# Altium schematic sheet PULSE_TRIGGER.SchDoc: =TopTitle
size 420 x 297 mm; EDA_Number: ARTIQ; CheckedBy: -; Author: G.Kasprowicz; CompanyName: WUT ISE; DrawnBy: G.Kasprowicz; Organization: WUT ISE; Address1: PW ISE; Address2: Nowowiejska 15/19 00-665 Warsaw; Address3: gkasprow@gmail.com; SheetNumber: -; SheetTotal: -; ModifiedBy: -; CheckedDate: -; Title2: Pulse Trigger; DivGrp: WUT ISE; Designer: G.Kasprowicz; ModifiedDate: -; ProjectName: Sensor Box
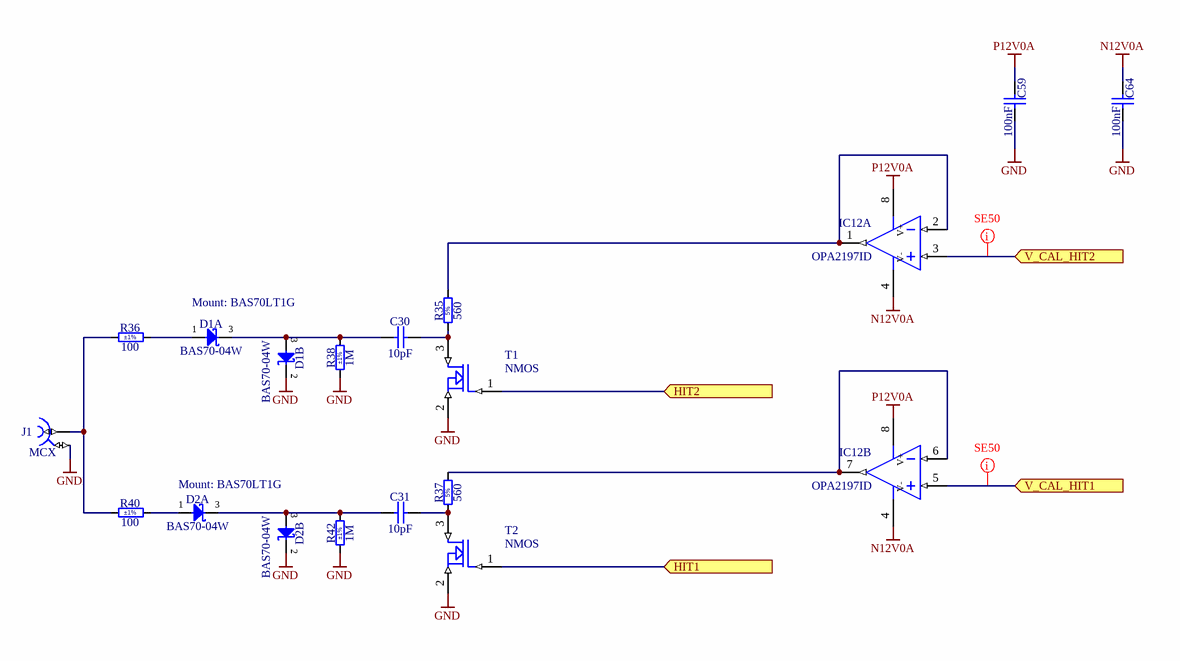
[diagram p0: PULSE_TRIGGER.SchDoc]

## Parts
C30  10pF  [CAPC1608X87N]
C31  10pF  [CAPC1608X87N]
C59  100nF  [CAPC1005X55N]
C64  100nF  [CAPC1005X55N]
D1  BAS70-04W  [SOT65P210X110-3N]  (parts A,B of 2)
D2  BAS70-04W  [SOT65P210X110-3N]  (parts A,B of 2)
IC12  OPA2197ID  [SOIC127P600X175-8N]  (parts A,B of 2)
J1  MCX  [AMPHENOL_919-383J-51A]
R35  560  [RESC2012X70N]
R36  100  Tolerance: ±1%  [RESC1608X55N]
R37  560  [RESC2012X70N]
R38  1M  Tolerance: ±1%  [RESC1608X55N]
R40  100  Tolerance: ±1%  [RESC1608X55N]
R42  1M  Tolerance: ±1%  [RESC1608X55N]
T1  NMOS  [CSD15380F3]
T2  NMOS  [CSD15380F3]

## Ports
HIT1 (in), HIT2 (in), V_CAL_HIT1 (in), V_CAL_HIT2 (in)

## Nets
GND: C59.1 C64.1 D1.2(C) D2.2(C) J1.2 R38.1 R42.1 T1.2(S) T2.2(S)
N12V0A: C64.2 IC12.4(V-)
P12V0A: C59.2 IC12.8(V+)
HIT1: T2.1(G) ; port HIT1
HIT2: T1.1(G) ; port HIT2
V_CAL_HIT1: IC12.5(IN+) ; port V_CAL_HIT1
V_CAL_HIT2: IC12.3(IN+) ; port V_CAL_HIT2
NetC30_1: C30.1 D1.3(COMAC) R38.2
NetC30_2: C30.2 R35.1 T1.3(D)
NetC31_1: C31.1 D2.3(COMAC) R42.2
NetC31_2: C31.2 R37.1 T2.3(D)
NetD1_1: D1.1(A) R36.2
NetD2_1: D2.1(A) R40.2
NetIC12_1: IC12.1(OUT) IC12.2(IN-) R35.2
NetIC12_6: IC12.6(IN-) IC12.7(OUT) R37.2
NetJ1_1: J1.1 R36.1 R40.1

## Layout directives
net class SE50: V_CAL_HIT1, V_CAL_HIT2

## Notes on the sheet
- (near D1) Mount: BAS70LT1G
- (near D2) Mount: BAS70LT1G
- Project/Equipment
- Document
- Designer
- Drawn by
- Check.by
- Copyright WUT ISE 2020.
  This documentation describes Open Hardware and is licensed under the CERN OHL v.1.2. You may redistribute and modify this documentation under the terms of the CERN OHL v.1.2. (http://ohwr.org/CERNOHL). This documentation is distributed WITHOUT ANY EXPRESS OR IMPLIED WARRANTY, INCLUDING OF MERCHANTABILITY, SATISFACTORY QUALITY AND FITNESS FOR A PARTICULAR PURPOSE. Please see the CERN OHL v.1.2 for applicable conditions.
- Contact
- File
- Last Mod.
- Print Date
- Sheet
- Size
- A3
- of
- Rev
- (in symbol R0805_560R_5%_0.25W_200PPM_PANASONIC_ERJT) 5%

## Library data of the parts
C30 C31 = CC0603_10PF_50V_5%_NP0: Non-polarised capacitor; Part Description: SMD Multilayer Chip Ceramic Capacitor; Manufacturer: GENERIC; Manufacturer1 Part Number: 223886715109; Voltage: 50V; TC: C0G/NP0; Tolerance: ±5%; Part Number: CC0603_10PF_50V_5%_NP0; Component Kind: Standard; Component Type: Standard; Pin Count: 2; Value: 10pF; Status: Preferred; Manufacturer Part Number: CC0603_10PF_50V_5%_NP0; Case: 0603; Mounted: Yes; Socket: No; SMD: Yes; Sense: No; Manufacturer1 Example: PHYCOMP; Manufacturer1 ComponentHeight: 0.87mm; HelpURL: \\cern.ch\dfs\Applications\Altium\Datasheets\CC0603_NP0_PHYCOMP.pdf; Author: CERN DEM JLC; CreateDate: 03.12.2007; LatestRevisionDate: 03.12.2007
C59 C64 = CC0402_100NF_16V_10%_X7R: Non-polarised capacitor; Part Description: SMD Multilayer Chip Ceramic Capacitor; Manufacturer: GENERIC; Manufacturer1 Part Number: GRM155R71C104KA88D; Voltage: 16V; TC: X7R; Tolerance: ±10%; Part Number: CC0402_100NF_16V_10%_X7R; Component Kind: Standard; Component Type: Standard; Pin Count: 2; Value: 100nF; Status: Not Recommended; Manufacturer Part Number: CC0402_100NF_16V_10%_X7R; Case: 0402; Mounted: Yes; Socket: No; SMD: Yes; Sense: No; Manufacturer1 Example: MURATA; Manufacturer1 ComponentHeight: 0.55mm; HelpURL: \\cern.ch\dfs\Applications\Altium\Datasheets\CC0402_X7R_MURATA_GRM.pdf; Author: CERN DEM JLC; CreateDate: 05.12.2013; LatestRevisionDate: 03.12.2007
D1 D2 = BAS70-04W: Serial Schottky Diode; Part Description: Dual Series General-Purpose Schottky Diodes; Manufacturer: NXP SEMICONDUCTORS; Voltage: 70V; Power: 70mA; PressFit: No; Bonding: No; Part Number: BAS70-04W; Component Kind: Standard; Component Type: Standard; Device: BAS70-04W; PackageDescription: SOT323, 0.65mm Pitch; 3 Pin, 1.25mm W X 2.00mm L X 1.10mm H body, IPC Medium Density; Manufacturer Part Number: BAS70-04W; Pin Count: 3; Case: SOT323; Mounted: Yes; Socket: No; SMD: Yes; Sense: No; ComponentHeight: 1.10mm; HelpURL: \\cern.ch\dfs\Applications\Altium\Datasheets\BAS70-04W.pdf; Author: CERN DEM JLC; CreateDate: 05.12.2013; LatestRevisionDate: 05.12.2013
IC12 = OPA2197ID: Dual Operational Amplifier; Part Description: Dual, 36-V, Precision, Rail-to-Rail Input/Output, Low Offset Voltage, Operational Amplifiers; Manufacturer: TEXAS INSTRUMENTS; PressFit: No; Bonding: No; Part Number: OPA2197ID; Component Kind: Standard; Component Type: Standard; Device: OPA2197ID; PackageDescription: SOIC 8, Pitch 1.27mm - Body 4x5mm, IPC Medium Density; Manufacturer Part Number: OPA2197ID; Pin Count: 8; Case: SOIC8; Mounted: Yes; Socket: No; SMD: Yes; Sense: No; ComponentHeight: 1.75mm; Author: CERN DEM MR; HelpURL: \\cern.ch\dfs\Applications\Altium\Datasheets\OPA2197ID.pdf; CreateDate: 07.08.2019; LatestRevisionDate: 07.08.2019
J1 = AMPHENOL_919-383J-51A: Part Description: 50 Ohms, RF Connector, MCX Right Angle PCB Receptacle Jack; PressFit: No; Part Number: AMPHENOL_919-383J-51A; Component Kind: Standard; Component Type: Standard; Pin Count: 5; Family: MCX; Mounted: Yes; Socket: No; SMD: No; Sense: No; Status: None; Manufacturer: AMPHENOL; Manufacturer Part Number: 919-383J-51A; ComponentHeight: 6mm; HelpURL: \\cern.ch\dfs\Applications\Altium\Datasheets\AMPHENOL_919-383J-51A.pdf; Author: CERN DEM BC; CreateDate: 31.01.2019; LatestRevisionDate: 31.01.2019
R35 R37 = R0805_560R_5%_0.25W_200PPM_PANASONIC_ERJT: Resistor - 5%; Part Description: 200V, Anti-Pulse Thick Film Chip Resistor; Manufacturer Part Number: ERJT06J561V; Power: 0.25W; TC: ±200ppm/°C; Voltage: 200V; PressFit: No; Part Number: R0805_560R_5%_0.25W_200PPM_PANASONIC_ERJT; Component Kind: Standard; Component Type: Standard; Pin Count: 2; Value: 560; Status: None; Tolerance: ±5%; Manufacturer: PANASONIC; Case: 0805; Mounted: Yes; Sense: No; Socket: No; SMD: Yes; ComponentHeight: 0.7mm; HelpURL: \\cern.ch\dfs\Applications\Altium\Datasheets\R0805_PANASONIC_ERJT06.pdf; Author: CERN DEM MR; CreateDate: 08.01.2018; LatestRevisionDate: 08.01.2018
R36 R40 = R0603_100R_1%_0.1W_100PPM: Resistor - 1%; Part Description: General Purpose Thick Film Chip Resistor; Manufacturer: GENERIC; Manufacturer1 Part Number: NRC06F4700TRF; Power: 0.1W; TC: ±100ppm/°C; PressFit: No; Part Number: R0603_100R_1%_0.1W_100PPM; Component Kind: Standard; Component Type: Standard; Pin Count: 2; Value: 100; Status: Preferred; Manufacturer Part Number: R0603_100R_1%_0.1W_100PPM; Case: 0603; Mounted: Yes; Sense: No; Socket: No; SMD: Yes; Manufacturer1 Example: NIC COMPONENT; Manufacturer1 ComponentHeight: 0.55mm; HelpURL: \\cern.ch\dfs\Applications\Altium\Datasheets\R0603_NIC_NRC.pdf; Author: CERN DEM JLC; CreateDate: 03.12.2007; LatestRevisionDate: 13.03.2008
R38 R42 = R0603_1M_1%_0.1W_100PPM: Resistor - 1%; Part Description: General Purpose Thick Film Chip Resistor; Manufacturer: GENERIC; Manufacturer1 Part Number: NRC06F1004TRF; Power: 0.1W; TC: ±100ppm/°C; PressFit: No; Part Number: R0603_1M_1%_0.1W_100PPM; Component Kind: Standard; Component Type: Standard; Pin Count: 2; Value: 1M; Status: Preferred; Manufacturer Part Number: R0603_1M_1%_0.1W_100PPM; Case: 0603; Mounted: Yes; Sense: No; Socket: No; SMD: Yes; Manufacturer1 Example: NIC COMPONENT; Manufacturer1 ComponentHeight: 0.55mm; HelpURL: \\cern.ch\dfs\Applications\Altium\Datasheets\R0603_NIC_NRC.pdf; Author: CERN DEM JLC; CreateDate: 03.12.2007; LatestRevisionDate: 13.03.2008
T1 T2 = Q_MOSFET N: 20-V, N channel NexFET™ power MOSFET, single LGA 0.6 mm x 0.7 mm, 1460 mOhm, gate ESD protection; Manufacturer Part Number: CSD15380F3